# Altium schematic sheet Sheet2.SchDoc
size A4
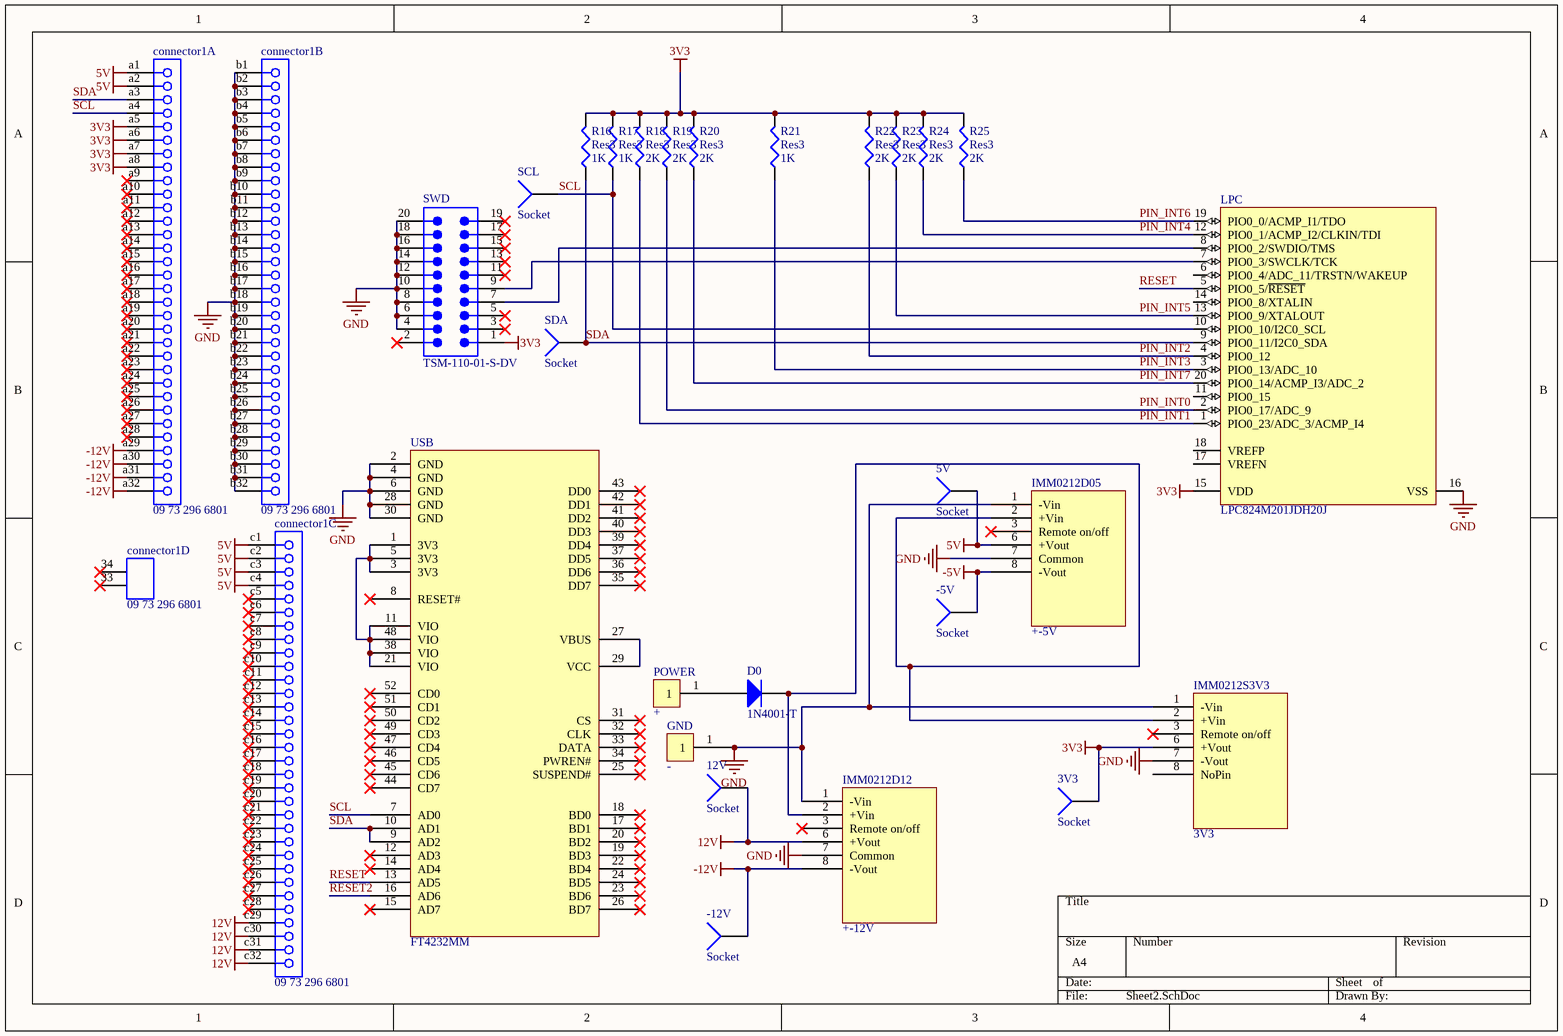
[diagram p0: Sheet2.SchDoc]

## Parts
3V3  Socket  [CON1]
5V  Socket  [CON1]
12V  Socket  [CON1]
-5V  Socket  [CON1]
-12V  Socket  [CON1]
connector1  09 73 296 6801  [0973296X801]  (parts A,B,C,D of 4)
D0  1N4001-T  [DIOD-DO-41-P-2_V]
GND  -  [RA]
IMM0212D05  +-5V  [SIP8]
IMM0212D12  +-12V  [SIP8]
IMM0212S3V3  3V3  [SIP8]
LPC  LPC824M201JDH20J  [NXP-SOT360-1_N]
POWER  +  [RA]
R16  Res3  value 1K  [J1-0603]
R17  Res3  value 1K  [J1-0603]
R18  Res3  value 2K  [J1-0603]
R19  Res3  value 2K  [J1-0603]
R20  Res3  value 2K  [J1-0603]
R21  Res3  value 1K  [J1-0603]
R22  Res3  value 2K  [J1-0603]
R23  Res3  value 2K  [J1-0603]
R24  Res3  value 2K  [J1-0603]
R25  Res3  value 2K  [J1-0603]
SCL  Socket  [CON1]
SDA  Socket  [CON1]
SWD  TSM-110-01-S-DV  [SMTC-TSM-110-01-X-DV]
USB  FT4232MM  [FT4232MM]

## Nets
3V3: 3V3.1 connector1.a5 connector1.a6 connector1.a7 connector1.a8 IMM0212S3V3.6(+Vout) LPC.15(VDD) R16.2 R17.2 R18.2 R19.2 R20.2 R21.2 R22.2 R23.2 R24.2 R25.2 SWD.1
5V: 5V.1 connector1.a1 connector1.a2 connector1.c1 connector1.c2 connector1.c3 connector1.c4 IMM0212D05.6(+Vout)
12V: 12V.1 connector1.c29 connector1.c30 connector1.c31 connector1.c32 IMM0212D12.6(+Vout)
-5V: -5V.1 IMM0212D05.8(-Vout)
-12V: -12V.1 connector1.a29 connector1.a30 connector1.a31 connector1.a32 IMM0212D12.8(-Vout)
GND: connector1.b1 connector1.b2 connector1.b3 connector1.b4 connector1.b5 connector1.b6 connector1.b7 connector1.b8 connector1.b9 connector1.b10 connector1.b11 connector1.b12 connector1.b13 connector1.b14 connector1.b15 connector1.b16 connector1.b17 connector1.b18 connector1.b19 connector1.b20 connector1.b21 connector1.b22 connector1.b23 connector1.b24 connector1.b25 connector1.b26 connector1.b27 connector1.b28 connector1.b29 connector1.b30 connector1.b31 connector1.b32 GND.1 IMM0212D05.1(-Vin) IMM0212D05.7(Common) IMM0212D12.1(-Vin) IMM0212D12.7(Common) IMM0212S3V3.1(-Vin) IMM0212S3V3.7(-Vout) LPC.16(VSS) SWD.4 SWD.6 SWD.8 SWD.10 SWD.12 SWD.14 SWD.16 SWD.18 SWD.20 USB.2(GND) USB.4(GND) USB.6(GND) USB.28(GND) USB.30(GND)
PIN_INT0: LPC.2(PIO0_17/ADC_9) R19.1
PIN_INT1: LPC.1(PIO0_23/ADC_3/ACMP_I4) R18.1
PIN_INT2: LPC.4(PIO0_12) R22.1
PIN_INT3: LPC.3(PIO0_13/ADC_10) R21.1
PIN_INT4: LPC.12(PIO0_1/ACMP_I2/CLKIN/TDI) R24.1
PIN_INT5: LPC.13(PIO0_9/XTALOUT) R23.1
PIN_INT6: LPC.19(PIO0_0/ACMP_I1/TDO) R25.1
PIN_INT7: LPC.20(PIO0_14/ACMP_I3/ADC_2) R20.1
RESET: LPC.5(PIO0_5/~{RESET}) USB.13(AD5)
RESET2: USB.16(AD6)
SCL: connector1.a4 LPC.10(PIO0_10/I2C0_SCL) R17.1 SCL.1 USB.7(AD0)
SDA: connector1.a3 LPC.9(PIO0_11/I2C0_SDA) R16.1 SDA.1 USB.9(AD2) USB.10(AD1)
NetD0_1: D0.1(A) POWER.1
NetD0_2: D0.2(K) IMM0212D05.2(+Vin) IMM0212D12.2(+Vin) IMM0212S3V3.2(+Vin)
NetLPC_7: LPC.7(PIO0_3/SWCLK/TCK) SWD.9
NetLPC_8: LPC.8(PIO0_2/SWDIO/TMS) SWD.7
NetUSB_1: USB.1(3V3) USB.3(3V3) USB.5(3V3) USB.11(VIO) USB.21(VIO) USB.38(VIO) USB.48(VIO)
NetUSB_27: USB.27(VBUS) USB.29(VCC)

Not connected (* = marked no-connect by the designer): connector1 33(MH1)* 34(MH2)* a9* a10* a11* a12* a13* a14* a15* a16* a17* a18* a19* a20* a21* a22* a23* a24* a25* a26* a27* a28* c5* c6* c7* c8* c9* c10* c11* c12* c13* c14* c15* c16* c17* c18* c19* c20* c21* c22* c23* c24* c25* c26* c27* c28*; IMM0212D05 3(Remote_on/off)*; IMM0212D12 3(Remote_on/off)*; IMM0212S3V3 3(Remote_on/off)* 8(NoPin); LPC 6(PIO0_4/ADC_11/TRSTN/WAKEUP) 11(PIO0_15) 14(PIO0_8/XTALIN) 17(VREFN) 18(VREFP); SWD 2* 3* 5* 11* 13* 15* 17* 19*; USB 8(RESET#)* 12(AD3)* 14(AD4)* 15(AD7)* 17(BD1)* 18(BD0)* 19(BD3)* 20(BD2)* 22(BD4)* 23(BD6)* 24(BD5)* 25(SUSPEND#)* 26(BD7)* 31(CS)* 32(CLK)* 33(DATA)* 34(PWREN#)* 35(DD7)* 36(DD6)* 37(DD5)* 39(DD4)* 40(DD3)* 41(DD2)* 42(DD1)* 43(DD0)* 44(CD7)* 45(CD6)* 46(CD5)* 47(CD4)* 49(CD3)* 50(CD2)* 51(CD1)* 52(CD0)*

## Library data of the parts
connector1 = 09 73 296 6801: Eurocard DIN 41612, Type R, 96 Position, Rows a+b+c, Performance level 2, Female, Lead 3.0 mm, Pitch 2.54 mm; DrillSize: Corresponds to nominal value.; Published: 6-Oct-2005; DatasheetDocument: 24-Nov-2004; PackageDocument: 17-Aug-1998; PackageReference: 0973296X801; Publisher: Altium Limited; ComponentLink1Description: Manufacturer Link; ComponentLink1URL: http://www.harting.com/; ComponentLink2Description: Packaging Specification; ComponentLink2URL: http://www.harkis.harting.com/_gds/pdf/TB_0973296x801_BL01_R31100.pdf
D0 = CMP-0639-00006-2: 1.0 A Rectifier, 15 pF, 50 V, -65 to 150 degC, 2-Pin DO-41 Plastic, RoHS, Tape and Reel; Manufacturer: Diodes Inc; VF (V): 1; CT (pF): 15; Max. IR (uA): 5; VRRM (V): 50; Max. IFSM (A): 30; RoHS: TRUE; Mounting Technology: Through Hole; PartNumber: 1N4001-T; ComponentLink2Description: Datasheet; DatasheetVersion: Rev. 8-2; Operating Temperature Range (degC): -65 to 150; Packing: Tape and Reel; PackageReference: DO-41-P-2; ComponentLink1URL: http://diodes.com/; PackageDescription: 2-Pin Axial Lead, Body 4.635 x 2.36 mm, Lead Spread 25.4 mm; ComponentLink2URL: http://diodes.com/datasheets/ds28002.pdf; Max. Average Rectified Current IO (A): 1; ComponentLink1Description: Manufacturer URL
GND POWER = Power
IMM0212D05 IMM0212D12 = IMM0212D05
IMM0212S3V3 = Component_1
LPC = CMP-0173-00095-1: 32-bit ARM Cortex-M0+ Microcontroller, 16 I/O, 32 KB Flash, 8 KB SRAM, -40 to 105 degC, 20-Pin TSSOP, Reel, RoHS; Manufacturer: NXP Semiconductors; Clock Speed: 30 MHz max.; Flash: 32 KB; RAM: 8 KB; Mounting Technology: Surface Mount; Packing: Reel; Code_JEDEC: MO-153; ComponentLink2Description: Datasheet; Core: Cortex-M0+; ComponentLink1URL: www.nxp.com; ComponentLink3Description: Package Specification; ComponentLink1Description: Manufacturer URL; ComponentLink2URL: http://www.nxp.com/documents/data_sheet/LPC82X.pdf; ComponentLink3URL: http://www.nxp.com/documents/outline_drawing/sot360-1_po.pdf; PartNumber: LPC824M201JDH20; DatasheetVersion: Rev. 1; PackageDescription: 20-Pin Plastic Thin Shrink Small Outline Package, Body 6.5 x 4.4 mm, Pitch 0.65 mm; PackageVersion: 03-02-19, 02/2003
R16-R25 = Res3: Resistor; Published: 8-Jun-2000; LatestRevisionDate: 29-May-2009; LatestRevisionNote: IPC-7351 Footprint Added.; PackageReference: J1-0603; Publisher: Altium Limited; PackageDescription: Chip Resistor; Supplier 1: Farnell
  R16 R17: Supplier Part Number 1: 2059601RL
  R18-R25: Supplier Part Number 1: 2059611
SWD = CMP-1024-00283-1: 0.025" SQ Post Header, Surface Mount, Vertical, -55 to 125 degC, 2.54 mm Pitch, 20-Pin, Male, RoHS; Manufacturer: Samtec; Pitch: 2.54 mm; DatasheetVersion: F-214; ComponentLink2Description: Datasheet; ComponentLink3URL: http://www.samtec.com/documents/webfiles/cpdf/TSM-1XX-XX-XXX-XX-X-XXX-X-MKT.pdf; ComponentLink1Description: Manufacturer URL; PackageDescription: Double Row Gullwing ASM; ComponentLink1URL: http://www.samtec.com; PackageVersion: DJ, 4/1991; ComponentLink2URL: http://www.samtec.com/documents/webfiles/pdf/TSM.PDF; Mounting Technology: Surface Mount; Temperature Range: -55 to 125 degC; PartNumber: TSM-110-01-S-DV; ComponentLink3Description: Package Specification; Orientation: Vertical; PackageReference: TSM-110-01-X-DV; RoHS: True
USB = FT4232MM: FDTI mini module
3V3 5V 12V -5V -12V SCL SDA = Socket: LatestRevisionDate: 17-Jul-2002; LatestRevisionNote: Re-released for DXP Platform.; Publisher: Altium Limited